# EAGLE board RF08-1 (EAGLE 6.6.0), part 1 of 2
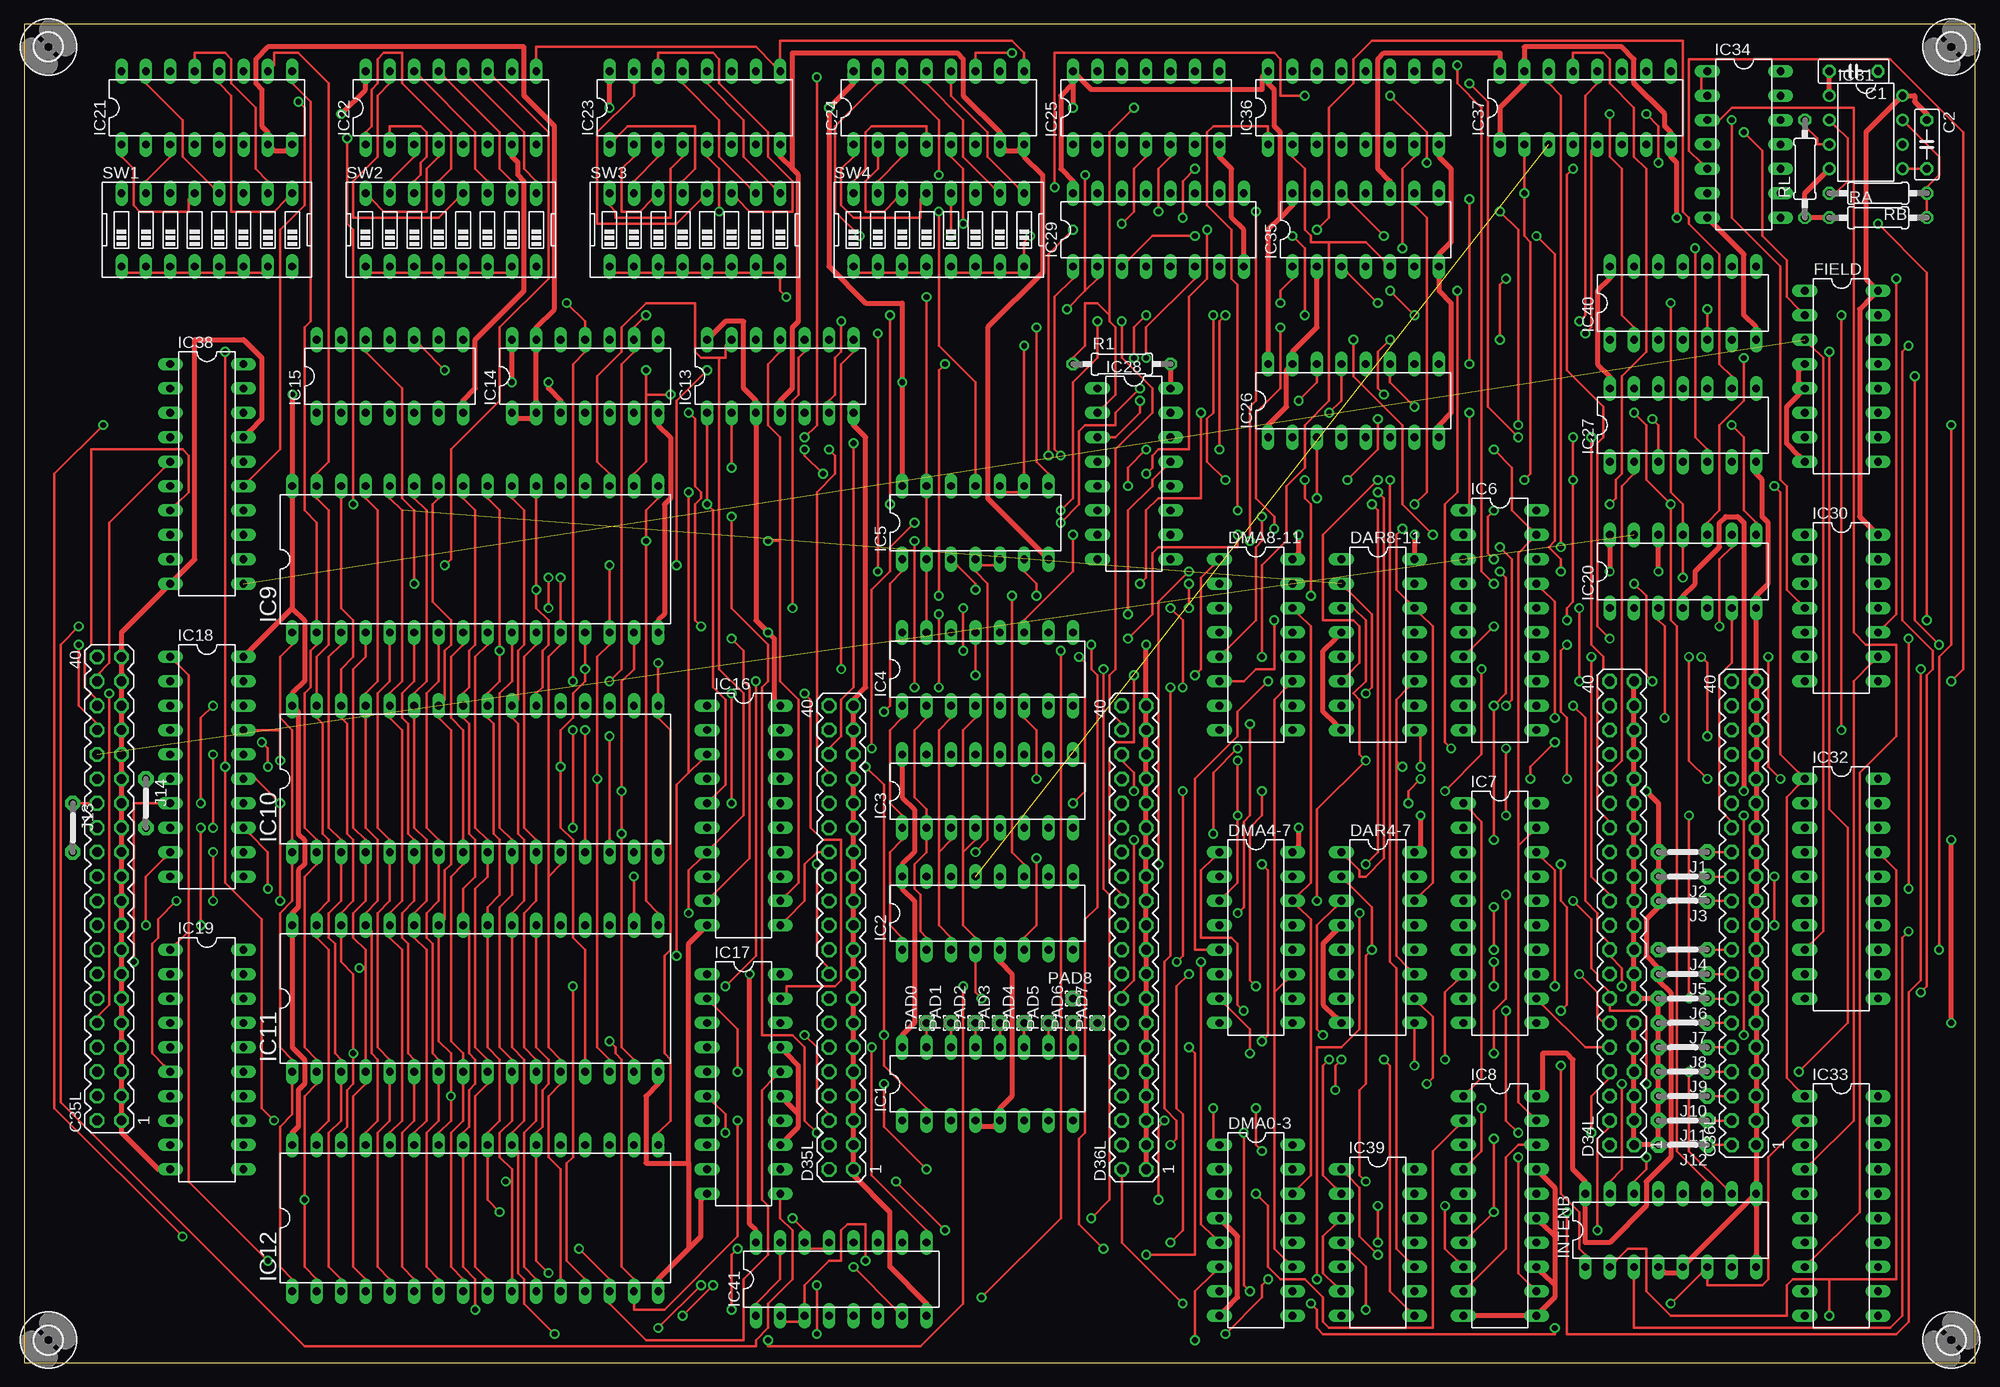
[diagram p3: board, top side]
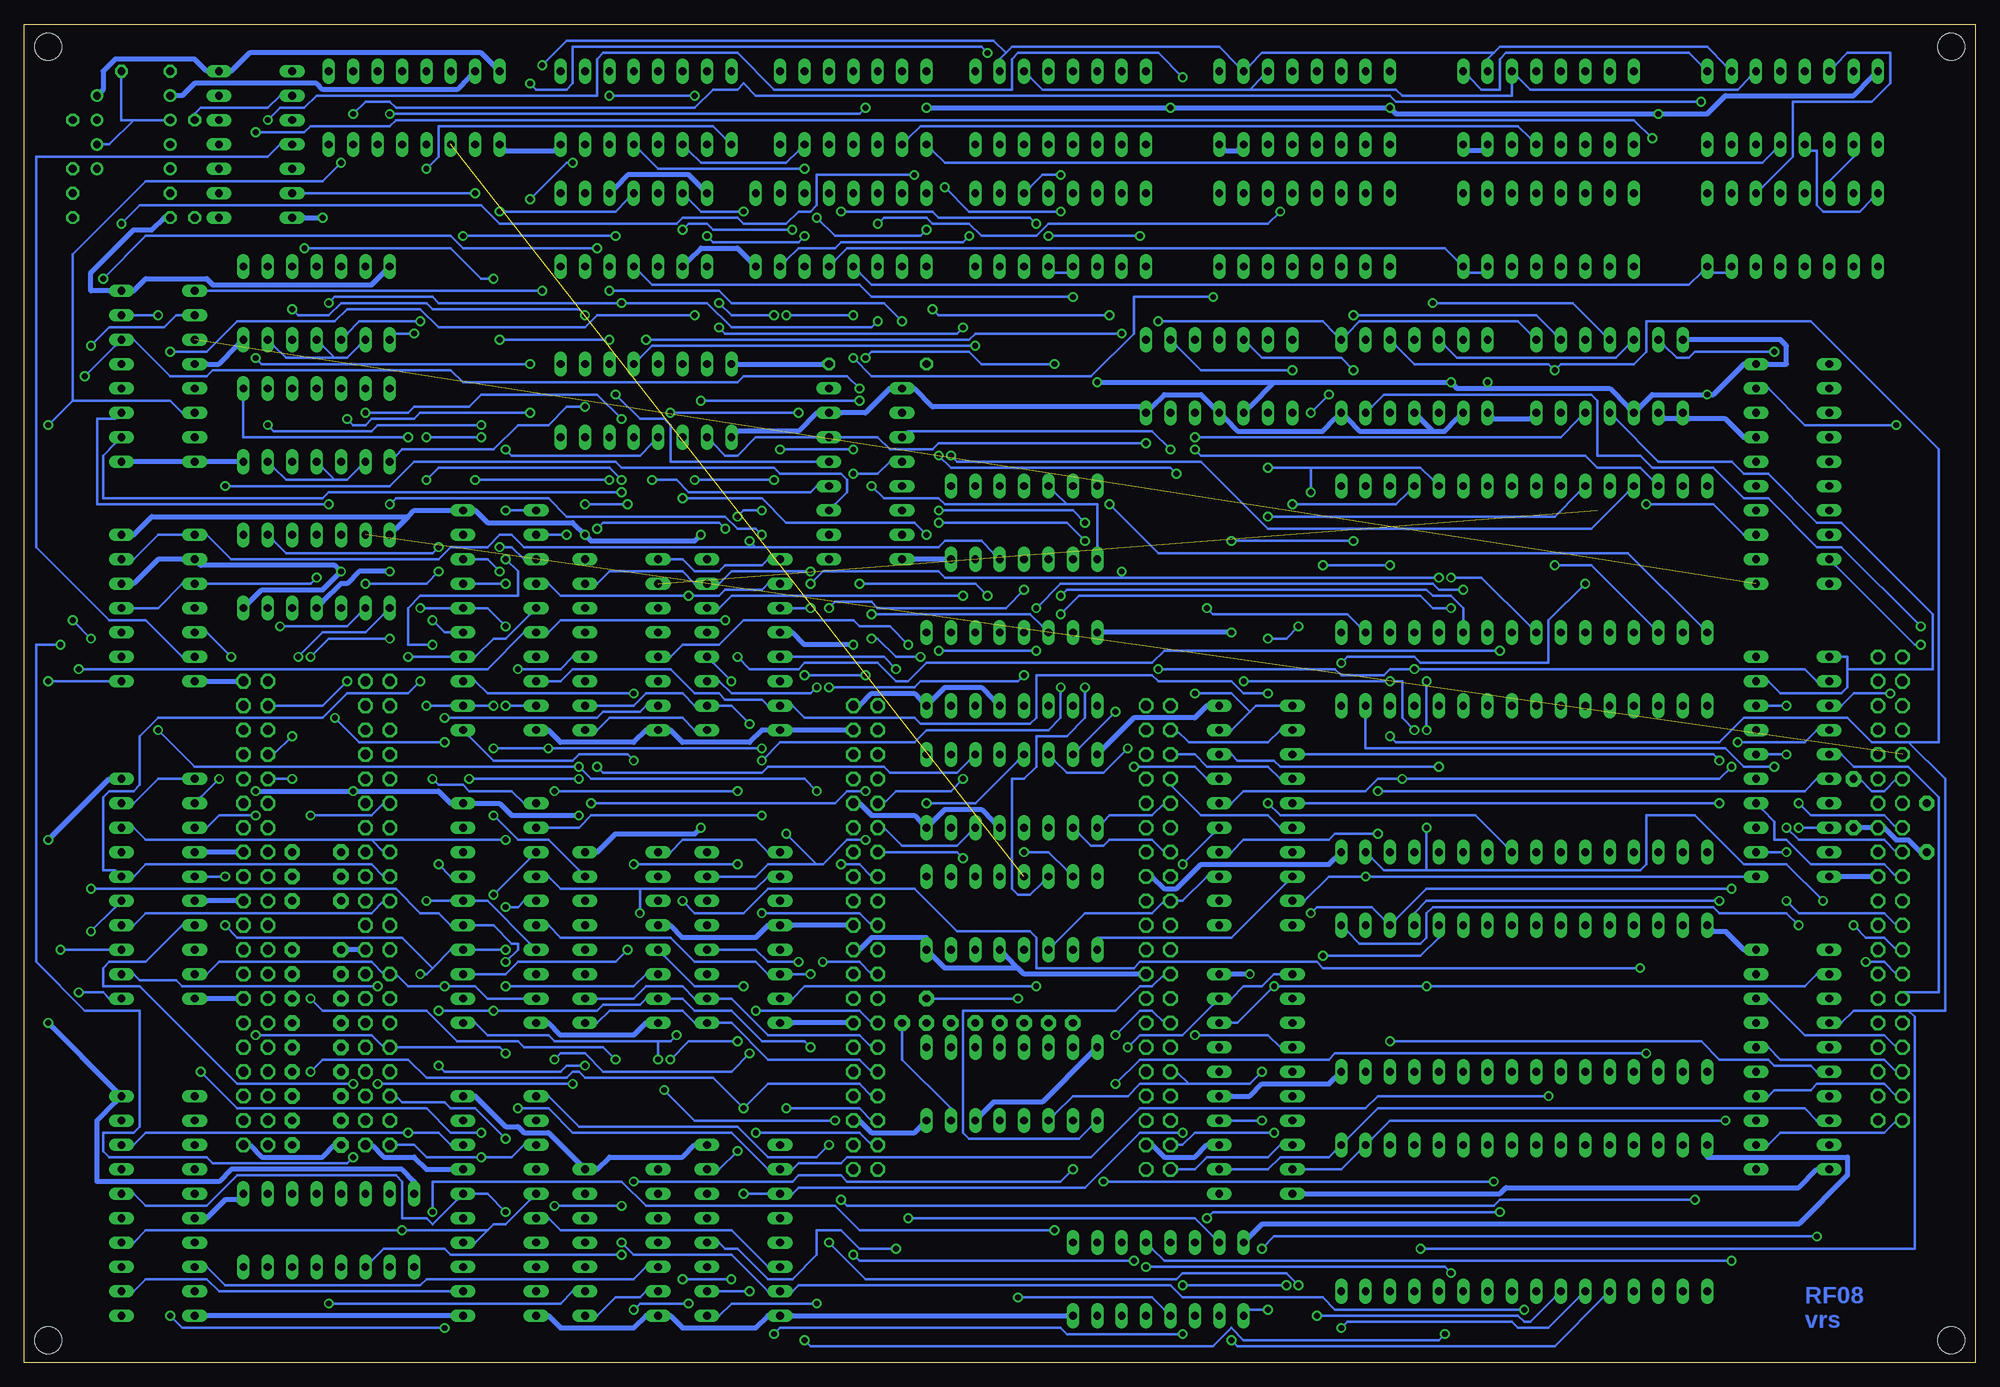
[diagram p4: board, bottom side, seen from below]

Size 203.18 x 139.37 mm. Coordinates in mm from the lower left corner, seen from the top.
Outline: 0,0 203.18,0 203.18,139.37 0,139.37 0,0
Copper layers (1*16): Top 0.035mm / dielectric 1.5mm / Bottom 0.035mm
Design rules "default": minimum track width 10mil, minimum drill 24mil, track to track 8mil, track to pad 8mil, pad to pad 8mil, via to via 8mil, smd to smd 8mil, copper to edge 40mil, drill to drill 8mil, minimum pad ring 10mil, minimum via ring 8mil, stop-mask expansion 4mil, vias tented up to drill 0mil, thermal gap 10mil
Net classes: 1 Power: width 0.508 mm

## Footprints (pad centres in the part's own frame; a part is rotated, then mirrored left to right if it is on the bottom)
C050-025X075 = drill 0.813 octagon: 1 -2.54,0; 2 2.54,0
MA20-2 = drill 1.016 octagon: 1 -24.13,-1.27; 2 -24.13,1.27; 3 -21.59,-1.27; 4 -21.59,1.27; 5 -19.05,-1.27; 6 -19.05,1.27; 7 -16.51,-1.27; 8 -16.51,1.27; 9 -13.97,-1.27; 10 -13.97,1.27; 11 -11.43,-1.27; 12 -11.43,1.27; 13 -8.89,-1.27; 14 -8.89,1.27; 15 -6.35,-1.27; 16 -6.35,1.27; 17 -3.81,-1.27; 18 -3.81,1.27; 19 -1.27,-1.27; 20 -1.27,1.27; 21 1.27,-1.27; 22 1.27,1.27; 23 3.81,-1.27; 24 3.81,1.27; 25 6.35,-1.27; 26 6.35,1.27; 27 8.89,-1.27; 28 8.89,1.27; 29 11.43,-1.27; 30 11.43,1.27; 31 13.97,-1.27; 32 13.97,1.27; 33 16.51,-1.27; 34 16.51,1.27; 35 19.05,-1.27; 36 19.05,1.27; 37 21.59,-1.27; 38 21.59,1.27; 39 24.13,-1.27; 40 24.13,1.27
DIL16 = drill 0.813 long: 1 -8.89,-3.81; 2 -6.35,-3.81; 3 -3.81,-3.81; 4 -1.27,-3.81; 5 1.27,-3.81; 6 3.81,-3.81; 7 6.35,-3.81; 8 8.89,-3.81; 9 8.89,3.81; 10 6.35,3.81; 11 3.81,3.81; 12 1.27,3.81; 13 -1.27,3.81; 14 -3.81,3.81; 15 -6.35,3.81; 16 -8.89,3.81
DIL14 = drill 0.813 long: 1 -7.62,-3.81; 2 -5.08,-3.81; 3 -2.54,-3.81; 4 0,-3.81; 5 2.54,-3.81; 6 5.08,-3.81; 7 7.62,-3.81; 8 7.62,3.81; 9 5.08,3.81; 10 2.54,3.81; 11 0,3.81; 12 -2.54,3.81; 13 -5.08,3.81; 14 -7.62,3.81
DIL20 = drill 0.813 long: 1 -11.43,-3.81; 2 -8.89,-3.81; 3 -6.35,-3.81; 4 -3.81,-3.81; 5 -1.27,-3.81; 6 1.27,-3.81; 7 3.81,-3.81; 8 6.35,-3.81; 9 8.89,-3.81; 10 11.43,-3.81; 11 11.43,3.81; 12 8.89,3.81; 13 6.35,3.81; 14 3.81,3.81; 15 1.27,3.81; 16 -1.27,3.81; 17 -3.81,3.81; 18 -6.35,3.81; 19 -8.89,3.81; 20 -11.43,3.81
DIL32 = drill 0.813 long: 1 -19.05,-7.62; 2 -16.51,-7.62; 3 -13.97,-7.62; 4 -11.43,-7.62; 5 -8.89,-7.62; 6 -6.35,-7.62; 7 -3.81,-7.62; 8 -1.27,-7.62; 9 1.27,-7.62; 10 3.81,-7.62; 11 6.35,-7.62; 12 8.89,-7.62; 13 11.43,-7.62; 14 13.97,-7.62; 15 16.51,-7.62; 16 19.05,-7.62; 17 19.05,7.62; 18 16.51,7.62; 19 13.97,7.62; 20 11.43,7.62; 21 8.89,7.62; 22 6.35,7.62; 23 3.81,7.62; 24 1.27,7.62; 25 -1.27,7.62; 26 -3.81,7.62; 27 -6.35,7.62; 28 -8.89,7.62; 29 -11.43,7.62; 30 -13.97,7.62; 31 -16.51,7.62; 32 -19.05,7.62
DIL08 = drill 0.813 pad 1.27: 1 -3.81,-3.81; 2 -1.27,-3.81; 3 1.27,-3.81; 4 3.81,-3.81; 5 3.81,3.81; 6 1.27,3.81; 7 -1.27,3.81; 8 -3.81,3.81
05 = drill 0.813 pad 1.6 octagon: 1 -2.54,0; 2 2.54,0
1,6/0,8 = drill 0.813 pad 1.6 octagon: 1 0,0
0207/10 = drill 0.813 octagon: 1 -5.08,0; 2 5.08,0
EDG-08 = drill 0.813 long: 1 -8.89,-3.81; 2 -6.35,-3.81; 3 -3.81,-3.81; 4 -1.27,-3.81; 5 1.27,-3.81; 6 3.81,-3.81; 7 6.35,-3.81; 8 8.89,-3.81; 9 8.89,3.81; 10 6.35,3.81; 11 3.81,3.81; 12 1.27,3.81; 13 -1.27,3.81; 14 -3.81,3.81; 15 -6.35,3.81; 16 -8.89,3.81
2,8 = hole 2.8: 0,0

## Placement (x,y rotation side)
C1  .1uf  [C050-025X075]  190.5,134.46 180 top
C2  .1uf  [C050-025X075]  198.12,126.83 270 top
C35L  [MA20-2]  8.88,49.37 90 top
C36L  [MA20-2]  179.06,46.83 90 top
D34L  [MA20-2]  166.37,46.83 90 top
D35L  [MA20-2]  85.09,44.29 90 top
D36L  [MA20-2]  115.56,44.29 90 top
DAR4-7  74LS193N  [DIL16]  140.97,44.29 270 top
DAR8-11  74LS193N  [DIL16]  140.97,74.77 270 top
DMA0-3  74LS193N  [DIL16]  128.27,13.81 270 top
DMA4-7  74LS193N  [DIL16]  128.27,44.29 270 top
DMA8-11  74LS193N  [DIL16]  128.27,74.77 270 top
FIELD  74LS193N  [DIL16]  189.22,102.7 270 top
IC1  74S138N  [DIL16]  100.33,29.05 0 top
IC2  74S138N  [DIL16]  100.33,46.83 0 top
IC3  74S138N  [DIL16]  100.33,59.52 0 top
IC4  74S138N  [DIL16]  100.33,72.22 0 top
IC5  74LS00N  [DIL14]  99.06,87.46 0 top
IC6  74S240N  [DIL20]  153.66,77.3 270 top
IC7  74S240N  [DIL20]  153.66,46.83 270 top
IC8  74S240N  [DIL20]  153.66,16.35 270 top
IC9  628512  [DIL32]  46.98,83.65 0 top
IC10  628512  [DIL32]  46.98,60.8 0 top
IC11  628512  [DIL32]  46.98,37.94 0 top
IC12  628512  [DIL32]  46.98,15.08 0 top
IC13  74180N  [DIL14]  78.73,102.7 0 top
IC14  74180N  [DIL14]  58.41,102.7 0 top
IC15  74180N  [DIL14]  38.09,102.7 0 top
IC16  74LS244N  [DIL20]  74.93,56.98 270 top
IC17  74LS244N  [DIL20]  74.93,29.05 270 top
IC18  74S240N  [DIL20]  19.05,62.06 270 top
IC19  74S240N  [DIL20]  19.05,31.59 270 top
IC20  74S74N  [DIL14]  172.72,82.38 0 top
IC21  74LS151N  [DIL16]  19.05,130.65 0 top
IC22  74LS151N  [DIL16]  44.45,130.65 0 top
IC23  74LS151N  [DIL16]  69.84,130.65 0 top
IC24  74LS151N  [DIL16]  95.25,130.65 0 top
IC25  74LS20N  [DIL14]  116.84,130.65 0 top
IC26  74S139N  [DIL16]  138.43,100.16 0 top
IC27  7407N  [DIL14]  172.72,97.62 0 top
IC28  74S139N  [DIL16]  115.56,92.54 270 top
IC29  74LS139N  [DIL16]  118.11,117.94 0 top
IC30  74S74N  [DIL14]  189.22,78.57 270 top
IC31  LM555N  [DIL08]  191.77,128.11 270 top
IC32  74S240N  [DIL20]  189.22,49.37 270 top
IC33  74S240N  [DIL20]  189.22,16.35 270 top
IC34  74LS00N  [DIL14]  179.06,126.83 270 top
IC35  74S74N  [DIL14]  139.69,117.94 0 top
IC36  74S139N  [DIL16]  138.43,130.65 0 top
IC37  74LS139N  [DIL16]  162.56,130.65 0 top
IC38  74S240N  [DIL20]  19.05,92.54 270 top
IC39  74S03N  [DIL14]  140.97,12.54 270 top
IC40  7407N  [DIL14]  172.72,110.32 0 top
IC41  74LS139N  [DIL16]  85.09,8.73 0 top
INTENB  74LS193N  [DIL16]  171.44,13.81 0 top
J1  J5MM  [05]  172.72,53.18 180 top
J2  J5MM  [05]  172.72,50.63 180 top
J3  J5MM  [05]  172.72,48.09 180 top
J4  J5MM  [05]  172.72,43.02 180 top
J5  J5MM  [05]  172.72,40.48 180 top
J6  J5MM  [05]  172.72,37.94 180 top
J7  J5MM  [05]  172.72,35.4 180 top
J8  J5MM  [05]  172.72,32.86 180 top
J9  J5MM  [05]  172.72,30.32 180 top
J10  J5MM  [05]  172.72,27.78 180 top
J11  J5MM  [05]  172.72,25.23 180 top
J12  J5MM  [05]  172.72,22.7 180 top
J13  J5MM  [05]  5.08,55.72 270 top
J14  J5MM  [05]  12.69,58.26 270 top
PAD0  [1,6/0,8]  93.98,35.4 90 top
PAD1  [1,6/0,8]  96.52,35.4 90 top
PAD2  [1,6/0,8]  99.06,35.4 90 top
PAD3  [1,6/0,8]  101.59,35.4 90 top
PAD4  [1,6/0,8]  104.14,35.4 90 top
PAD5  [1,6/0,8]  106.68,35.4 90 top
PAD6  [1,6/0,8]  109.22,35.4 90 top
PAD7  [1,6/0,8]  111.76,35.4 90 top
PAD8  [1,6/0,8]  109.22,37.94 90 top
R1  4.7K  [0207/10]  114.3,103.97 0 top
RA  470K  [0207/10]  193.03,119.21 0 top
RB  1.5K  [0207/10]  193.03,121.75 180 top
RL  1K  [0207/10]  185.41,124.29 90 top
SW1  [EDG-08]  19.05,117.94 0 top
SW2  [EDG-08]  44.45,117.94 0 top
SW3  [EDG-08]  69.84,117.94 0 top
SW4  [EDG-08]  95.25,117.94 0 top
U$1  [2,8]  200.66,137 0 top
U$2  [2,8]  2.54,137 0 top
U$3  [2,8]  2.54,2.38 0 top
U$4  [2,8]  200.66,2.38 0 top

## Tracks (layer width: path | path; a pad name or v marks a point on that pad's centre or on a via)
!3CYC
  Top 0.254: C35L.28 6.98,58.26 5.71,58.26 J13.1
!601  (via drill 0.61)
  Top 0.254: v99.06,53.18 100.33,54.45 100.33,81.11 99.06,82.38 IC5.4 99.69,83.02 100.96,83.02 IC5.5 | v128.27,119.85 128.27,100.16 127.63,99.53 v127.63,85.56
  Bottom 0.254: IC30.13 191.77,83.65 189.22,86.19 186.69,86.19 IC30.1 184.15,86.19 181.61,83.65 160.02,83.65 158.75,84.92 154.94,84.92 153.66,86.19 152.4,86.19 151.12,84.92 127,84.92 | v99.06,53.18 96.52,53.18 94.61,51.27 IC2.15 | v128.27,119.85 132.71,119.85 133.98,121.12 IC35.13 | v127.63,85.56 127,84.92 | 127,84.92 107.95,84.92 107.31,85.56 103.5,85.56 102.23,84.29 IC5.5
!602  (via drill 0.61)
  Top 0.254: v89.53,67.78 90.17,68.41 90.17,81.11 91.44,82.38 IC5.1 | v130.81,110.32 130.81,111.59 132.08,112.86 IC35.1 | v125.09,109.05 124.45,108.42 v124.45,95.08 | v116.84,95.08 114.93,93.18 v114.93,91.27
  Bottom 0.254: 94.61,89.37 91.44,89.37 91.44,84.92 IC5.1 | 94.61,89.37 95.88,90.64 IC5.12 | v89.53,67.78 93.34,63.97 IC3.15 | v130.81,110.32 129.53,109.05 v125.09,109.05 | v116.84,95.08 v124.45,95.08 | v114.93,91.27 113.66,90 107.95,90 107.31,89.37 94.61,89.37
!604  (via drill 0.61)
  Top 0.254: IC4.15 93.98,77.3 93.98,82.38 IC5.2 93.98,84.92 93.98,90 IC5.13 93.98,92.54 v93.98,110.96
  Bottom 0.254: v93.98,110.96 114.93,110.96 116.2,112.23 137.79,112.23 139.06,113.5 IC35.4
!611  (via drill 0.61)
  Top 0.254: v92.7,85.56 v92.7,70.32 | v107.95,87.46 109.85,89.37 109.85,96.99 110.48,97.62 113.66,97.62 113.66,98.89 v116.2,101.43 | v168.91,21.43 168.91,20.16 167.63,18.89 INTENB.14 | v199.38,74.77 196.84,77.3 v196.84,102.7
  Bottom 0.254: v92.7,70.32 92.7,67.14 94.61,65.24 97.79,65.24 97.79,62.06 99.06,60.8 100.33,60.8 100.33,49.37 99.69,48.73 98.42,48.73 97.15,50 IC2.14 | v92.7,85.56 94.61,87.46 v107.95,87.46 | v116.2,101.43 117.47,102.7 128.27,102.7 128.9,102.07 157.47,102.07 158.75,103.34 183.51,103.34 184.15,102.7 187.96,102.7 191.77,106.52 FIELD.14 193.67,105.88 v196.84,102.7 | v168.91,21.43 169.54,20.79 183.51,20.79 184.15,21.43 194.31,21.43 194.94,22.06 194.94,23.96 191.77,23.96 191.13,24.6 191.13,36.66 196.84,36.66 201.93,41.74 201.93,74.77 v199.38,74.77
!612  (via drill 0.61)
  Top 0.254: v88.26,63.97 88.26,80.48 90.17,82.38 90.17,84.92 v92.7,87.46 | v107.95,88.73 109.22,90 109.22,102.07 111.76,104.61 v111.76,108.42 | v144.78,109.05 v142.24,111.59 | v175.25,109.69 175.25,107.78 IC40.5
  Bottom 0.254: v88.26,63.97 90.8,61.43 94.61,61.43 95.88,62.7 IC3.14 | v92.7,87.46 93.98,88.73 v107.95,88.73 | v111.76,108.42 113.66,110.32 129.53,110.32 130.81,111.59 v142.24,111.59 | v144.78,109.05 145.41,109.69 160.65,109.69 161.28,110.32 170.18,110.32 171.44,109.05 174.62,109.05 v175.25,109.69
!614  (via drill 0.61)
  Top 0.254: v114.93,77.94 114.93,88.73 117.47,91.27 117.47,91.91 118.74,93.18 IC28.13 | v173.99,116.04 173.99,96.35 175.25,95.08 IC27.5 | v154.3,112.86 153.66,112.23 v153.66,106.52 | v142.24,106.52 140.97,105.24 140.97,101.43 v141.6,100.8
  Bottom 0.254: v114.93,77.94 98.42,77.94 97.15,76.67 IC4.14 | v173.99,116.04 158.75,116.04 155.57,112.86 v154.3,112.86 | v153.66,106.52 v142.24,106.52 | v141.6,100.8 139.06,98.26 136.52,98.26 135.88,97.62 135.88,93.81 120.65,93.81 IC28.13
!621  (1 unrouted)
!622  (via drill 0.61)
  Top 0.254: v109.22,58.26 110.48,59.52 110.48,72.86 v109.85,73.49 | v114.93,75.4 117.47,77.94 117.47,84.29 118.11,84.92 126.36,84.92 v126.36,86.19 | v165.09,89.37 165.73,90 165.73,91.91 166.37,92.54 166.37,102.7 168.91,105.24 168.91,124.29 167.63,125.56 167.63,130.65 165.09,133.19 165.09,135.72 164.46,136.36 161.28,136.36 161.28,135.72 IC37.13
  Bottom 0.254: v109.22,58.26 104.14,58.26 99.69,62.7 IC3.13 | v109.85,73.49 112.39,73.49 114.3,75.4 v114.93,75.4 | v126.36,86.19 127,86.83 128.9,86.83 130.17,88.1 146.68,88.1 148.59,90 164.46,90 v165.09,89.37
!624  (via drill 0.61)
  Top 0.254: v150.49,98.89 150.49,89.37 IC6.1 | v169.54,98.26 170.18,97.62 170.18,95.08 IC27.3 | v99.06,71.59 99.06,74.77 IC4.13 | v119.38,70.32 119.38,42.38 118.74,41.74 118.74,26.51 120.01,25.23 120.01,23.33 v119.38,22.7 | IC7.1 150.49,57.62 151.76,56.35 151.76,29.68 150.49,28.41 IC8.1 | v153.03,88.73 152.4,88.1 152.4,84.29 v153.03,83.65 | v160.65,74.77 160.02,74.13 160.02,67.78 160.65,67.14 v160.65,60.8
  Bottom 0.254: v150.49,98.89 161.92,98.89 162.56,98.26 167,98.26 167.63,97.62 168.91,97.62 v169.54,98.26 | v99.06,71.59 99.69,70.95 109.85,70.95 110.48,70.32 v119.38,70.32 | v119.38,22.7 120.65,21.43 125.73,21.43 128.9,24.6 145.41,24.6 148.59,27.78 IC8.1 | v153.03,88.73 151.12,88.73 IC6.1 | v153.03,83.65 151.76,82.38 151.76,79.84 161.92,79.84 163.19,78.57 163.19,74.77 v160.65,74.77 | v160.65,60.8 160.02,60.16 157.47,60.16 156.84,59.52 152.4,59.52 151.12,58.26 IC7.1
!641  (via drill 0.61)
  Top 0.254: v102.87,79.84 102.87,53.18 104.14,51.91 IC2.11 | v116.2,81.11 116.84,81.75 116.84,88.73 118.11,90 122.55,90 v122.55,98.89 | v135.88,98.89 137.16,100.16 137.16,102.7 IC26.13
  Bottom 0.254: v102.87,79.84 104.14,81.11 v116.2,81.11 | v122.55,98.89 v135.88,98.89
!642  (via drill 0.61)
  Top 0.254: v143.5,62.06 142.87,62.7 | 142.87,62.7 142.87,69.05 144.14,70.32 DAR8-11.11 | 142.87,62.7 142.87,42.38 144.14,41.11 DAR4-7.11
  Bottom 0.254: v143.5,62.06 142.87,61.43 126.36,61.43 125.73,62.06 113.66,62.06 113.03,61.43 106.04,61.43 104.77,62.7 IC3.11
!644  (via drill 0.61)
  Top 0.254: v109.22,86.19 109.22,82.38 104.14,77.3 IC4.11 | v134.62,90 134.62,95.08 IC26.3
  Bottom 0.254: v109.22,86.19 110.48,87.46 123.82,87.46 126.36,90 v134.62,90
!645  (via drill 0.61)
  Top 0.254: 155.57,53.81 155.57,27.14 156.84,25.87 IC8.19 | 155.57,53.81 156.84,55.08 IC7.19 | 155.57,53.81 155.57,84.29 156.84,85.56 IC6.19 156.84,86.83 154.94,88.73 154.94,93.18 v153.03,95.08
  Bottom 0.254: v153.03,95.08 152.4,94.45 139.06,94.45 137.79,95.72 IC26.4
!ACB00  (via drill 0.61)
  Top 0.254: v155.57,21.43 155.57,9.36 156.84,8.09 IC8.12
  Bottom 0.254: IC8.3 151.12,22.7 152.4,21.43 v155.57,21.43 161.28,21.43 162.56,22.7 164.46,22.7 D34L.2 | IC8.12 158.75,7.46 182.88,7.46 184.15,8.73 190.5,8.73 191.77,7.46 IC33.12
!ACB01  (via drill 0.61)
  Top 0.254: v163.83,13.81 163.83,23.33 165.09,24.6 D34L.4
  Bottom 0.254: 154.94,13.81 154.3,14.44 153.03,14.44 150.49,16.98 IC8.5 | 154.94,13.81 156.21,12.54 IC8.14 | 154.94,13.81 v163.83,13.81 190.5,13.81 191.77,12.54 IC33.14
!ACB02  (via drill 0.61)
  Top 0.254: IC8.7 150.49,13.17 v153.03,15.71 v153.03,23.33
  Bottom 0.254: v153.03,15.71 154.94,17.62 156.21,17.62 IC8.16 158.11,16.98 160.65,14.44 161.28,15.08 163.83,15.08 163.83,18.89 164.46,19.52 180.97,19.52 184.15,16.35 190.5,16.35 191.77,17.62 IC33.16 | v153.03,23.33 156.21,26.51 158.75,26.51 159.38,27.14 163.83,27.14 164.46,27.78 D34L.6
!ACB03  (via drill 0.61)
  Top 0.254: IC8.9 150.49,8.09 154.3,11.9 154.3,21.43 155.57,22.7 156.21,22.7 IC8.18 | v163.19,23.96 163.19,27.78 165.09,29.68 D34L.8
  Bottom 0.254: IC33.18 191.77,22.7 190.5,23.96 v163.19,23.96 160.02,23.96 158.75,22.7 IC8.18
!ACB04  (via drill 0.61)
  Top 0.254: v154.3,48.73 154.3,37.94 153.03,36.66 v153.03,32.22 | IC7.12 158.11,37.3 162.56,32.86 164.46,32.86 D34L.10 | v179.06,34.12 v179.06,56.98
  Bottom 0.254: v154.3,48.73 150.49,52.54 IC7.3 | v153.03,32.22 153.66,32.86 164.46,32.86 D34L.10 165.73,32.86 167,34.12 v179.06,34.12 | v179.06,56.98 182.88,56.98 184.15,55.72 IC32.3
!ACB05  (via drill 0.61)
  Top 0.254: v161.92,40.48 163.83,38.57 163.83,36.03 164.46,35.4 D34L.12 | v153.03,43.02 v153.03,47.46 | v182.24,45.55 v182.24,50.63
  Bottom 0.254: 160.65,41.11 161.28,40.48 v161.92,40.48 | 160.65,41.11 158.75,43.02 IC7.14 156.21,43.02 v153.03,43.02 | v153.03,47.46 151.76,47.46 151.12,48.09 IC7.5 | v182.24,50.63 184.15,50.63 IC32.5 | v182.24,45.55 180.97,44.29 163.83,44.29 160.65,41.11
!ACB06  (via drill 0.61)
  Top 0.254: v168.91,29.05 168.91,36.03 168.27,36.66 165.09,36.66 165.09,37.3 D34L.14 165.09,38.57 163.83,39.84 163.83,40.48 163.19,41.11 163.19,46.19 v161.28,48.09
  Bottom 0.254: IC7.7 150.49,43.65 154.94,48.09 156.21,48.09 IC7.16 158.75,48.09 v161.28,48.09 | v168.91,29.05 180.97,29.05 191.13,39.2 194.94,39.2 194.94,41.11 194.31,41.74 190.5,41.74 186.69,45.55 IC32.7
!ACB07  (via drill 0.61)
  Top 0.254: v159.38,39.2 159.38,51.27 158.11,52.54 IC7.18
  Bottom 0.254: IC7.9 151.12,37.94 154.94,37.94 156.21,39.2 v159.38,39.2 163.19,39.2 164.46,40.48 D34L.16 165.73,40.48 167,41.74 182.88,41.74 184.15,40.48 IC32.9
!ACB08  (via drill 0.61)
  Top 0.254: v166.37,39.2 166.37,41.11 165.09,42.38 D34L.18 165.09,43.65 163.83,44.92 163.83,46.83 162.56,48.09 162.56,67.14 v161.28,68.41 | v153.66,84.92 154.94,83.65 154.94,69.05 v154.3,68.41
  Bottom 0.254: v166.37,39.2 186.69,39.2 187.32,39.84 191.13,39.84 191.77,40.48 IC32.12 | v161.28,68.41 158.75,68.41 IC6.12 156.21,68.41 v154.3,68.41 | v153.66,84.92 152.4,84.92 151.12,83.65 IC6.3
!ACB09  (via drill 0.61)
  Top 0.254: v163.19,73.49 163.19,50.63 165.09,48.73 D34L.22
  Bottom 0.254: IC6.5 150.49,77.94 153.03,75.4 154.3,75.4 156.21,73.49 IC6.14 158.75,73.49 v163.19,73.49 | IC32.14 191.77,45.55 190.5,46.83 167,46.83 165.73,48.09 D34L.22
!ACB10  (via drill 0.61)
  Top 0.254: v153.03,76.67 150.49,74.13 IC6.7 | v161.92,70.95 v161.92,78.57
  Bottom 0.254: v153.03,76.67 154.94,78.57 156.21,78.57 IC6.16 158.75,78.57 v161.92,78.57 | D34L.24 165.73,50.63 167,51.91 190.5,51.91 191.77,50.63 IC32.16 193.67,51.27 194.94,51.27 194.94,58.89 194.31,59.52 191.77,59.52 191.13,60.16 191.13,65.24 189.22,67.14 172.08,67.14 169.54,69.68 163.19,69.68 v161.92,70.95
!ACB11  (via drill 0.61)
  Top 0.254: v153.66,82.38 154.3,81.75 154.3,69.68 v153.03,68.41 v153.03,54.45
  Bottom 0.254: v153.03,68.41 151.12,68.41 IC6.9 | v153.66,82.38 154.94,83.65 156.21,83.65 IC6.18 | 167,54.45 190.5,54.45 191.77,55.72 IC32.18 | 167,54.45 165.73,53.18 D34L.26 | v153.03,54.45 167,54.45
!ACCLEAR
  Top 0.254: D34L.32 165.09,61.43 166.37,62.7 166.37,91.27 167.63,92.54 IC27.2
  Bottom 0.254: 170.81,91.91 169.54,91.91 168.27,93.18 IC27.2 | 170.81,91.91 172.08,93.18 IC27.4 | 170.81,91.91 175.89,91.91 177.16,93.18 IC27.6
!BADDAC  (via drill 0.61)
  Top 0.254: v174.62,73.49 175.25,72.86 v175.25,65.24
  Bottom 0.254: v174.62,73.49 172.08,76.03 167.63,76.03 165.73,77.94 IC20.1 | v175.25,65.24 177.16,63.34 C36L.34
!BBREAK  (via drill 0.61)
  Top 0.254: IC41.1 76.2,6.18 78.73,8.73 78.73,11.27 IC41.15 | v128.9,88.1 128.9,85.56 128.27,84.92 128.27,77.3 125.09,74.13 DMA8-11.5 | v126.36,88.73 126.36,112.23 125.73,112.86 125.73,117.94 123.19,120.48 123.19,128.11 123.82,128.74 129.53,128.74 129.53,128.11 IC36.1 | v175.25,60.8 173.35,62.7 v173.35,73.49 | v165.09,75.4 163.83,76.67 163.83,95.72 164.46,96.35 164.46,99.53 160.65,103.34 160.65,123.66 v161.28,124.29 | v111.12,15.08 113.03,16.98 113.03,48.73 112.39,49.37 v112.39,72.22 | v8.25,97.62 3.17,92.54 3.17,26.51 v16.51,13.17 | v74.29,11.9 73.66,11.27 v73.66,5.55
  Bottom 0.254: v128.9,88.1 128.27,88.73 v126.36,88.73 | v175.25,60.8 177.16,60.8 C36L.32 | v173.35,73.49 171.44,75.4 v165.09,75.4 | v161.28,124.29 160.02,125.56 160.02,128.74 131.44,128.74 130.17,127.47 IC36.1 | v111.12,15.08 81.28,15.08 79.37,13.17 IC41.15 | v112.39,72.22 113.66,73.49 123.19,73.49 DMA8-11.5 | v8.25,97.62 17.78,97.62 21.59,101.43 IC38.19 | v16.51,13.17 73.02,13.17 v74.29,11.9 | v73.66,5.55 75.56,5.55 IC41.1
!BINIT  (via drill 0.61)
  Top 0.254: v141.6,117.31 137.79,121.12 IC35.12 | v157.47,117.31 159.38,115.4 159.38,85.56 158.75,84.92 160.02,83.65 v160.02,82.38 | v167.63,81.11 168.91,79.84 168.91,71.59 v169.54,70.95
  Bottom 0.254: v141.6,117.31 v157.47,117.31 | v160.02,82.38 161.28,81.11 v167.63,81.11 | v169.54,70.95 172.08,68.41 177.16,68.41 C36L.38
!BRK_RQ
  Top 0.254: IC20.6 177.8,77.3 177.8,72.86 176.53,71.59 176.53,57.62 177.8,56.35 C36L.28
!BWCO  (1 unrouted)
!CA_INCR
  Bottom 0.254: C35L.30 8.25,60.8 9.52,59.52 10.79,59.52 12.06,60.8 J14.1
!DA00
  Top 0.254: C36L.2 177.16,22.7 175.89,22.7 J12.1
!DA01
  Top 0.254: C36L.4 177.16,25.23 175.89,25.23 J11.1
!DA02
  Top 0.254: C36L.6 177.16,27.78 175.89,27.78 J10.1
!DA03
  Top 0.254: C36L.8 177.16,30.32 175.89,30.32 J9.1
!DA04
  Top 0.254: C36L.10 177.16,32.86 175.89,32.86 J8.1
!DA05
  Top 0.254: C36L.12 177.16,35.4 175.89,35.4 J7.1
!DA06
  Top 0.254: C36L.14 177.16,37.94 175.89,37.94 J6.1
!DA07
  Top 0.254: C36L.16 177.16,40.48 175.89,40.48 J5.1
!DA08
  Top 0.254: C36L.18 177.16,43.02 175.89,43.02 J4.1
!DA09
  Top 0.254: C36L.22 177.16,48.09 175.89,48.09 J3.1
!DA10
  Top 0.254: C36L.24 177.16,50.63 175.89,50.63 J2.1
!DA11
  Top 0.254: C36L.26 177.16,53.18 175.89,53.18 J1.1
!DATA00
  Bottom 0.254: IC19.12 21.59,22.7 20.32,23.96 9.52,23.96 8.25,25.23 C35L.2
!DATA01
  Bottom 0.254: IC19.14 21.59,27.78 20.95,28.41 17.14,28.41 16.51,29.05 9.52,29.05 8.25,27.78 C35L.4
!DATA02
  Bottom 0.254: IC19.16 21.59,32.86 20.32,31.59 9.52,31.59 8.25,30.32 C35L.6
!DATA03
  Bottom 0.254: IC19.18 21.59,37.94 17.78,34.12 9.52,34.12 8.25,32.86 C35L.8
!DATA04  (via drill 0.61)
  Top 0.254: v8.88,69.68 8.88,37.3 7.62,36.03 C35L.10
  Bottom 0.254: v8.88,69.68 12.69,69.68 13.96,68.41 IC18.3
!DATA05
  Bottom 0.254: IC18.5 13.96,63.34 12.69,62.06 6.98,62.06 3.81,58.89 3.81,38.57 7.62,38.57 C35L.12
!DATA06  (via drill 0.61)
  Top 0.254: v11.42,41.74 11.42,58.26 13.96,58.26 IC18.7
  Bottom 0.254: v11.42,41.74 9.52,41.74 8.25,40.48 C35L.14
!DATA07  (via drill 0.61)
  Top 0.254: v12.69,45.55 12.69,50.63 14.6,52.54 IC18.9
  Bottom 0.254: v12.69,45.55 11.42,44.29 9.52,44.29 8.25,43.02 C35L.16
!DATA08  (via drill 0.61)
  Top 0.254: v19.68,48.09 v19.68,53.18
  Bottom 0.254: v19.68,53.18 21.59,53.18 IC18.12 | v19.68,48.09 18.41,46.83 9.52,46.83 8.25,45.55 C35L.18
!DATA09
  Bottom 0.254: IC18.14 22.22,57.62 20.95,56.35 20.95,54.45 19.68,54.45 17.14,51.91 9.52,51.91 8.25,50.63 C35L.22
!DATA10  (via drill 0.61)
  Top 0.254: v19.68,55.72 v19.68,63.34
  Bottom 0.254: v19.68,63.34 21.59,63.34 IC18.16 | v19.68,55.72 18.41,54.45 9.52,54.45 8.25,53.18 C35L.24
!DATA11  (via drill 0.61)
  Top 0.254: v19.68,68.41 18.41,67.14 v18.41,58.26
  Bottom 0.254: v19.68,68.41 21.59,68.41 IC18.18 | v18.41,58.26 17.14,56.98 9.52,56.98 8.25,55.72 C35L.26
!DCXA  (via drill 0.61)
  Top 0.254: IC5.10 102.23,90.64 103.5,90.64 IC5.9 104.14,92.54 v104.14,105.88
  Bottom 0.254: v104.14,105.88 137.79,105.88 139.06,104.61 IC26.12
!DIMA  (via drill 0.61)
  Top 0.254: IC33.1 184.78,28.41 183.51,29.68 183.51,58.89 184.78,60.16 IC32.1 184.78,61.43 182.88,63.34 182.88,90.64 v182.24,91.27
  Bottom 0.254: v182.24,91.27 165.09,91.27 162.56,93.81 141.6,93.81 140.97,93.18 125.09,93.18 124.45,92.54 118.11,92.54 117.47,91.91 117.47,90.64 118.74,89.37 IC28.11 | IC32.19 191.77,58.26 189.22,60.8 186.69,60.8 IC32.1
!DIML  (via drill 0.61)
  Top 0.254: INTENB.11 175.25,18.89 172.08,22.06 172.08,76.67 171.44,77.3 v171.44,89.37 168.91,91.91 168.91,97.62 v167.63,98.89 | v137.79,91.91 140.97,95.08 v140.97,98.26
  Bottom 0.254: v171.44,89.37 195.58,89.37 195.58,98.26 193.67,98.26 FIELD.11 | v137.79,91.91 135.25,91.91 133.98,90.64 121.28,90.64 120.65,91.27 IC28.12 | v140.97,98.26 143.5,100.8 155.57,100.8 156.84,99.53 162.56,99.53 163.19,98.89 v167.63,98.89
!DMA-IN  (via drill 0.61)
  Top 0.254: 17.14,44.92 15.87,43.65 IC19.1 | 17.14,44.92 17.14,71.59 15.87,72.86 IC18.1 | v25.39,10.63 17.14,18.89 17.14,44.92
  Bottom 0.254: 13.33,72.22 13.33,73.49 13.96,73.49 IC18.1 | 13.33,72.22 13.33,70.32 13.96,69.68 20.32,69.68 21.59,70.95 IC18.19 | v25.39,10.63 84.45,10.63 85.72,11.9 IC41.12 | 13.33,72.22 4.44,72.22 4.44,77.94 13.96,87.46 16.51,87.46 21.59,92.54 24.12,92.54 25.39,93.81 33.02,93.81 37.46,98.26 IC15.4
!DMA-OUT  (via drill 0.61)
  Top 0.254: v88.26,32.86 88.26,19.52 93.98,13.81 IC41.9 | v81.28,69.68 81.91,69.05 81.91,55.72 83.18,54.45 85.09,54.45 85.09,39.84 84.45,39.2 79.37,39.2 79.37,38.57 IC17.19
  Bottom 0.254: 75.56,67.78 74.93,68.41 72.39,68.41 IC16.1 | 75.56,67.78 77.47,65.88 IC16.19 | IC17.1 72.39,40.48 73.02,40.48 74.29,39.2 76.2,39.2 77.47,37.94 IC17.19 79.37,37.3 82.55,34.12 86.99,34.12 v88.26,32.86 | 75.56,67.78 77.47,69.68 v81.28,69.68
!DRV01  (via drill 0.61)
  Top 0.254: IC10.22 53.34,69.68 53.97,70.32 53.97,74.13 54.6,74.77 54.6,77.3 53.34,78.57 v53.34,80.48 53.34,90 IC9.22 | v99.69,6.82 107.95,15.08 v107.95,74.13 | v97.79,74.13 v97.79,78.57
  Bottom 0.254: v99.69,6.82 85.72,6.82 84.45,5.55 IC41.4 | v107.95,74.13 v97.79,74.13 | v97.79,78.57 95.25,81.11 56.51,81.11 55.88,80.48 v53.34,80.48
!DRV23  (via drill 0.61)
  Top 0.254: IC11.22 53.34,44.29 53.34,32.86 54.6,31.59 54.6,29.05 53.97,28.41 53.97,24.6 53.34,23.96 IC12.22 53.34,21.43 53.34,10.63 v54.6,9.36 | v86.36,10 90.8,5.55 IC41.7
  Bottom 0.254: v86.36,10 55.24,10 v54.6,9.36
!EXAD0  (via drill 0.61)
  Top 0.254: v5.71,74.77 5.71,68.41 7.62,66.51 C35L.34
  Bottom 0.254: v5.71,74.77 6.34,74.77 14.6,83.02 IC38.9
!EXAD1
  Top 0.254: IC38.7 15.87,89.37 17.14,90.64 17.14,94.45 16.51,95.08 6.98,95.08 6.98,74.77 6.34,74.13 6.34,70.32 7.62,69.05 C35L.36
!EXAD2
  Top 0.254: IC38.5 14.6,93.18 8.88,87.46 8.88,72.86 7.62,71.59 C35L.38
!INT_RQ  (via drill 0.61)
  Top 0.254: IC39.3 136.52,14.44 135.25,13.17 135.25,9.36 136.52,8.09 IC39.6 | v173.35,37.94 v173.35,56.98 | v141.6,31.59 142.24,30.95 142.24,7.46 144.14,5.55 IC39.8
  Bottom 0.254: IC39.6 138.43,7.46 139.06,6.82 141.6,6.82 143.5,4.92 IC39.8 | v173.35,56.98 167,56.98 165.73,58.26 D34L.30 | v173.35,37.94 172.08,36.66 161.28,36.66 158.11,33.49 151.76,33.49 151.12,32.86 142.87,32.86 v141.6,31.59
!IOS  (via drill 0.61)
  Top 0.254: v163.19,96.35 163.19,74.77 164.46,73.49 164.46,72.22 163.83,71.59 163.83,57.62 165.09,56.35 D34L.28
  Bottom 0.254: v163.19,96.35 180.34,96.35 180.34,100.16 IC27.8
!MYDEV  (via drill 0.61)
  Top 0.254: 97.79,53.18 97.79,45.55 99.06,44.29 IC2.4 99.06,41.74 99.06,38.57 v99.69,37.94 | 97.79,53.18 99.06,54.45 IC3.4 | 97.79,53.18 97.79,65.88 99.06,67.14 IC4.4
  Bottom 0.254: v99.69,37.94 108.58,37.94 PAD8.1
!PER
  Bottom 0.254: IC30.6 186.69,73.49 190.5,77.3 194.31,77.3 201.93,84.92 201.93,125.56 177.8,125.56 176.53,126.83 IC34.4
!SETPER  (via drill 0.61)
  Top 0.254: v81.28,96.35 82.55,97.62 v82.55,133.82 | v177.8,129.38 177.8,119.21 182.88,114.13 182.88,91.91 183.51,91.27 183.51,80.48 184.78,79.21 IC30.4
  Bottom 0.254: v81.28,96.35 43.17,96.35 41.27,98.26 IC15.5 | v82.55,133.82 85.09,136.36 99.69,136.36 100.33,135.72 100.33,132.55 125.09,132.55 128.9,136.36 142.87,136.36 143.5,135.72 143.5,131.92 172.72,131.92 173.99,130.65 176.53,130.65 v177.8,129.38
!SETWLS  (via drill 0.61)
  Top 0.254: v194.94,112.86 194.94,77.94 193.67,76.67 IC30.10 | v143.5,116.04 143.5,124.29 144.78,125.56 IC36.7
  Bottom 0.254: v194.94,112.86 190.5,117.31 158.75,117.31 157.47,116.04 v143.5,116.04
!SKIP  (via drill 0.61)
  Top 0.254: 113.03,109.05 113.03,108.42 113.66,107.78 113.66,100.8 112.39,99.53 IC28.2 | 113.03,109.05 111.76,110.32 110.48,110.32 110.48,105.88 109.22,104.61 R1.1 | v165.09,130.01 165.09,125.56 166.37,124.29 166.37,109.05 167.63,107.78 IC40.2 | v115.56,130.65 113.03,128.11 113.03,109.05
  Bottom 0.254: 170.81,104.61 169.54,104.61 168.27,105.88 IC40.2 | 170.81,104.61 172.08,105.88 IC40.4 | 170.81,104.61 175.89,104.61 177.16,105.88 IC40.6 | v165.09,130.01 116.2,130.01 v115.56,130.65
!START  (via drill 0.61)
  Top 0.254: 130.17,38.57 130.17,11.9 131.44,10.63 DMA0-3.11 | 130.17,38.57 131.44,39.84 DMA4-7.11 | 130.17,38.57 130.17,69.05 131.44,70.32 DMA8-11.11 | v99.06,80.48 99.06,81.11 97.15,83.02 IC5.3 | v119.38,78.57 120.65,77.3 v120.65,70.32
  Bottom 0.254: v99.06,80.48 100.96,78.57 114.3,78.57 114.93,79.21 118.74,79.21 v119.38,78.57 | v120.65,70.32 121.28,69.68 129.53,69.68 130.81,70.95 DMA8-11.11
!WE  (via drill 0.61)
  Top 0.254: IC12.29 35.55,23.96 36.82,25.23 36.82,31.59 36.19,32.22 36.19,44.92 IC11.29 35.55,46.83 36.82,48.09 36.82,54.45 35.55,55.72 35.55,67.14 IC10.29 35.55,69.68 36.82,70.95 36.82,88.73 35.55,90 IC9.29 | v121.92,124.29 120.65,123.02 v120.65,119.21 | v109.22,117.94 106.68,115.4 v106.68,94.45
  Bottom 0.254: v121.92,124.29 137.16,124.29 139.06,126.2 IC36.5 | v120.65,119.21 118.74,117.31 109.85,117.31 v109.22,117.94 | v106.68,94.45 106.04,93.81 80.64,93.81 73.66,86.83 40,86.83 36.19,90.64 IC9.29
!WLS  (via drill 0.61)
  Top 0.254: v200.66,70.95 201.93,72.22 201.93,128.11 194.31,135.72 173.35,135.72 173.35,126.2 174.62,124.93 IC34.5
  Bottom 0.254: v200.66,70.95 194.31,70.95 IC30.8
BAC00  (via drill 0.61)
  Top 0.254: v120.65,6.18 114.3,12.54 114.3,19.52 D36L.2
  Bottom 0.254: v120.65,6.18 129.53,6.18 130.81,4.92 DMA0-3.9
BAC01  (via drill 0.61)
  Top 0.254: v127.63,7.46 127,8.09 v127,23.96
  Bottom 0.254: v127.63,7.46 130.81,7.46 DMA0-3.10 | v127,23.96 116.2,23.96 114.93,22.7 D36L.4
BAC02  (via drill 0.61)
  Top 0.254: v123.82,26.51 123.82,23.33 DMA0-3.1
  Bottom 0.254: v123.82,26.51 116.2,26.51 114.93,25.23 D36L.6
BAC03  (via drill 0.61)
  Top 0.254: v128.9,22.06 128.27,22.7 v128.27,26.51 | v173.35,30.32 173.35,22.06 177.16,18.25 INTENB.10
  Bottom 0.254: v128.9,22.06 130.81,20.16 DMA0-3.15 | D36L.8 114.93,27.78 116.2,29.05 125.73,29.05 v128.27,26.51 131.44,29.68 144.78,29.68 145.41,30.32 146.05,30.32 146.68,29.68 161.28,29.68 163.19,31.59 172.08,31.59 v173.35,30.32
BAC04  (via drill 0.61)
  Top 0.254: v160.02,30.95 160.02,17.62 161.92,15.71 161.92,11.9 162.56,11.27 INTENB.1 | v144.78,30.95 144.78,34.76 DAR4-7.9
  Bottom 0.254: DAR4-7.9 143.5,35.4 142.24,36.66 134.62,36.66 133.34,35.4 DMA4-7.9 130.81,35.4 129.53,35.4 125.73,31.59 116.2,31.59 114.93,30.32 D36L.10 | v160.02,30.95 159.38,30.32 147.31,30.32 146.68,30.95 v144.78,30.95
BAC05  (via drill 0.61)
  Top 0.254: v166.37,29.05 166.37,20.16 165.09,18.89 INTENB.15 | v146.05,29.05 146.68,29.68 146.68,36.03 145.41,37.3 DAR4-7.10
  Bottom 0.254: DAR4-7.10 143.5,37.94 139.69,37.94 138.43,39.2 134.62,39.2 133.34,37.94 DMA4-7.10 130.81,37.94 129.53,37.94 125.73,34.12 116.2,34.12 114.93,32.86 D36L.12 | v146.05,29.05 v166.37,29.05
BAC06  (via drill 0.61)
  Top 0.254: v140.97,90.64 141.6,90 141.6,52.54 139.69,50.63 139.06,50.63 139.06,51.27 137.79,52.54 DAR4-7.1 | v127,36.66 126.36,37.3 126.36,43.65 125.73,44.29 122.55,44.29 122.55,51.27 123.82,52.54 DMA4-7.1
  Bottom 0.254: DMA4-7.1 125.73,53.18 127,54.45 134.62,54.45 135.88,53.18 DAR4-7.1 | v140.97,90.64 171.44,90.64 172.08,90 194.94,90 194.94,94.45 193.67,95.72 FIELD.10 | v127,36.66 116.2,36.66 114.93,35.4 D36L.14
BAC07  (via drill 0.61)
  Top 0.254: v115.56,54.45 115.56,39.84 114.3,38.57 D36L.16 | v154.3,63.97 v154.3,56.98 | v126.36,63.97 123.82,61.43 v123.82,55.08 | v149.22,111.59 149.22,90.64 147.95,89.37 147.95,64.6 v148.59,63.97
  Bottom 0.254: 120.65,51.91 120.01,51.91 117.47,54.45 v115.56,54.45 | 120.65,51.91 125.73,51.91 127,50.63 130.81,50.63 DMA4-7.15 | v154.3,56.98 151.76,54.45 148.59,54.45 145.41,51.27 DAR4-7.15 | v126.36,63.97 v148.59,63.97 v154.3,63.97 | v123.82,55.08 120.65,51.91 | v149.22,111.59 184.15,111.59 FIELD.1
BAC08  (via drill 0.61)
  Top 0.254: v189.22,65.88 v189.22,109.05 | v145.41,62.06 145.41,65.24 DAR8-11.9 | v120.01,41.74 120.65,42.38 v120.65,59.52
  Bottom 0.254: DMA8-11.9 133.34,65.88 134.62,67.14 142.24,67.14 143.5,65.88 DAR8-11.9 | v189.22,109.05 191.77,109.05 FIELD.15 | v189.22,65.88 185.41,62.06 v145.41,62.06 144.14,60.8 121.92,60.8 v120.65,59.52 | v120.01,41.74 116.2,41.74 114.93,40.48 D36L.18
BAC09  (via drill 0.61)
  Top 0.254: v126.36,46.83 127,47.46 127,56.35 127.63,56.98 v127.63,66.51
  Bottom 0.254: DAR8-11.10 143.5,68.41 139.69,68.41 138.43,69.68 134.62,69.68 133.34,68.41 DMA8-11.10 130.81,68.41 129.53,68.41 v127.63,66.51 | v126.36,46.83 116.2,46.83 114.93,45.55 D36L.22
BAC10  (via drill 0.61)
  Top 0.254: v115.56,71.59 115.56,64.6 113.66,64.6 113.03,63.97 113.03,50 114.3,48.73 D36L.24 | v121.92,71.59 122.55,72.22 122.55,81.75 123.82,83.02 DMA8-11.1
  Bottom 0.254: DMA8-11.1 125.73,83.65 126.36,83.02 130.17,83.02 130.81,82.38 133.34,82.38 134.62,83.65 135.88,83.65 DAR8-11.1 | v115.56,71.59 v121.92,71.59
BAC11  (via drill 0.61)
  Top 0.254: v118.11,51.91 118.11,79.21 v121.28,82.38
  Bottom 0.254: DAR8-11.15 143.5,81.11 142.24,82.38 134.62,82.38 133.34,81.11 DMA8-11.15 130.81,81.11 129.53,82.38 v121.28,82.38 | v118.11,51.91 116.2,51.91 114.93,50.63 D36L.26
BINIT  (via drill 0.61)
  Top 0.254: v172.72,81.75 172.72,84.92 IC20.11 172.72,87.46 172.72,89.37 171.44,90.64 v171.44,110.32 | v140.97,110.32 137.79,113.5 IC35.3 | v114.3,108.42 114.3,104.61 117.47,101.43 117.47,98.89 113.66,95.08 113.66,72.22 113.03,71.59 113.03,67.78 114.3,66.51 D36L.38
  Bottom 0.254: IC30.11 191.77,78.57 189.22,78.57 186.69,81.11 IC30.3 184.15,81.11 173.35,81.11 v172.72,81.75 | v171.44,110.32 170.81,110.96 160.65,110.96 160.02,110.32 v140.97,110.32 132.08,110.32 129.53,107.78 114.93,107.78 v114.3,108.42
BIOP1  (via drill 0.61)
  Top 0.254: v105.41,52.54 105.41,45.55 104.14,44.29 IC2.6
  Bottom 0.254: v105.41,52.54 106.04,53.18 113.66,53.18 D36L.28
BIOP2
  Bottom 0.254: IC3.6 104.77,55.08 106.04,53.81 111.76,53.81 113.66,55.72 D36L.30
BIOP4  (via drill 0.61)
  Top 0.254: v105.41,60.8 105.41,65.88 104.14,67.14 IC4.6
  Bottom 0.254: v105.41,60.8 106.68,59.52 112.39,59.52 113.66,58.26 D36L.32
BMB00
  Bottom 0.254: IC17.8 72.39,22.7 73.66,21.43 80.01,21.43 81.28,20.16 83.18,20.16 D35L.2
BMB01  (via drill 0.61)
  Top 0.254: v73.02,23.96 73.02,25.87 71.75,27.14 IC17.6
  Bottom 0.254: v73.02,23.96 81.28,23.96 82.55,22.7 83.18,22.7 D35L.4
BMB02  (via drill 0.61)
  Top 0.254: v81.28,34.12 82.55,32.86 82.55,27.14 83.81,25.87 D35L.6
  Bottom 0.254: v81.28,34.12 73.66,34.12 72.39,32.86 IC17.4
BMB03  (via drill 0.61)
  Top 0.254: v74.29,30.32 74.29,34.76 71.75,37.3 IC17.2
  Bottom 0.254: v74.29,30.32 75.56,29.05 81.91,29.05 | 81.91,29.05 83.18,30.32 D35L.10 | 81.91,29.05 86.99,29.05 88.26,27.78 93.98,27.78 95.88,25.87 IC1.3
BMB04  (via drill 0.61)
  Top 0.254: IC1.2 93.98,26.51 89.53,30.95 v89.53,34.12 89.53,60.16 v87.62,62.06
  Bottom 0.254: v89.53,34.12 86.99,36.66 85.72,36.66 84.45,35.4 D35L.14 | v87.62,62.06 81.28,62.06 80.01,60.8 IC16.17
BMB05  (via drill 0.61)
  Top 0.254: v82.55,51.91 82.55,42.38 83.81,41.11 D35L.18
  Bottom 0.254: IC1.1 92.07,24.6 93.34,23.33 104.77,23.33 105.41,23.96 105.41,36.66 89.53,36.66 86.99,39.2 85.72,39.2 84.45,40.48 D35L.18 | v82.55,51.91 79.37,55.08 IC16.15
BMB06
  Top 0.254: 95.25,53.18 95.25,45.55 96.52,44.29 IC2.3 | 95.25,53.18 96.52,54.45 IC3.3 | 95.25,53.18 95.25,65.88 96.52,67.14 IC4.3
  Bottom 0.254: IC16.13 80.01,50.63 82.55,48.09 83.18,48.09 D35L.24 84.45,48.09 85.72,46.83 92.7,46.83 95.88,43.65 IC2.3
BMB07
  Top 0.254: IC16.11 79.37,46.19 81.28,48.09 81.28,51.91 82.55,53.18 83.18,53.18 D35L.28 | IC2.2 93.98,44.29 93.34,44.92 93.34,48.73 92.7,49.37 92.7,51.91 93.98,53.18 93.98,54.45 IC3.2 93.98,56.98 93.98,57.62 92.7,58.89 92.7,65.88 93.98,67.14 IC4.2
  Bottom 0.254: D35L.28 84.45,53.18 85.72,54.45 90.17,54.45 90.8,53.81 92.07,53.81 93.34,55.08 IC3.2
BMB08
  Top 0.254: IC4.1 91.44,67.14 90.17,65.88 90.17,58.26 91.44,56.98 IC3.1 91.44,54.45 90.17,53.18 90.17,45.55 91.44,44.29 IC2.1
  Bottom 0.254: IC3.1 90.8,56.35 90.17,56.98 85.72,56.98 84.45,58.26 D35L.32 | IC16.8 71.75,50 77.47,44.29 91.44,44.29 IC2.1
BMB09  (via drill 0.61)
  Top 0.254: v116.2,100.16 116.2,98.89 113.66,96.35 113.03,96.35 IC28.3 | v132.71,100.16 134.62,102.07 134.62,102.7 IC26.14 | v83.81,95.08 84.45,94.45 84.45,92.54 82.55,90.64 82.55,62.7 83.81,61.43 D35L.34
  Bottom 0.254: IC16.6 72.39,55.72 73.66,56.98 80.64,56.98 83.81,60.16 D35L.34 | v116.2,100.16 v132.71,100.16 | v83.81,95.08 85.72,96.99 111.12,96.99 IC28.3
BMB10  (via drill 0.61)
  Top 0.254: v86.36,95.72 86.36,70.32 85.09,69.05 85.09,65.24 83.81,63.97 D35L.36
  Bottom 0.254: IC26.2 131.44,95.72 130.17,94.45 128.9,94.45 127,96.35 120.65,96.35 IC28.14 118.11,96.35 114.3,96.35 113.03,95.08 108.58,95.08 107.95,95.72 v86.36,95.72 | IC16.4 72.39,60.8 73.66,62.06 80.01,62.06 81.28,63.34 83.18,63.34 D35L.36
BMB11
  Bottom 0.254: IC16.2 72.39,65.88 73.66,64.6 81.91,64.6 83.18,65.88 D35L.38
BTS1  (via drill 0.61)
  Top 0.254: v170.81,67.14 170.81,76.67 170.18,77.3 IC20.3 | v159.38,64.6 156.84,62.06 v156.84,60.8 | v145.41,60.8 144.14,59.52 v144.14,58.26 | v115.56,59.52 115.56,61.43 114.3,62.7 D36L.36
  Bottom 0.254: v170.81,67.14 168.27,64.6 v159.38,64.6 | v145.41,60.8 v156.84,60.8 | v144.14,58.26 118.74,58.26 117.47,59.52 v115.56,59.52
BUSY  (via drill 0.61)
  Top 0.254: v176.53,76.67 176.53,83.65 177.8,84.92 IC20.9 | v160.02,84.92 160.02,131.92 158.75,133.19 IC37.14
  Bottom 0.254: v176.53,76.67 169.54,76.67 168.27,77.94 IC20.2 | v160.02,84.92 160.65,84.29 175.89,84.29 177.16,85.56 IC20.9
CIE  (via drill 0.61)
  Top 0.254: v140.97,11.27 139.06,13.17 139.06,18.25 137.79,19.52 IC39.1 | v196.21,44.92 195.58,44.29 195.58,4.92 194.31,3.65 167.63,3.65 167.63,8.73 INTENB.3
  Bottom 0.254: v140.97,11.27 158.75,11.27 159.38,11.9 165.73,11.9 167,10.63 INTENB.3 | v196.21,44.92 193.67,47.46 IC32.15
DAR04  (via drill 0.61)
  Top 0.254: IC41.2 79.37,4.28 80.64,4.28 IC41.3 81.28,6.18 81.28,8.09 83.81,10.63 85.09,10.63 85.09,13.81 85.72,14.44 87.62,14.44 v87.62,10.63 | v160.02,36.66 160.65,37.3 160.65,47.46 160.02,48.09 v160.02,51.91 | v121.92,117.31 117.47,117.31 114.93,114.77 IC29.3 | v132.08,117.31 133.34,116.04 v133.34,109.05 | v187.96,105.24 187.96,57.62 189.86,55.72 189.86,35.4 v184.78,30.32 | v155.57,23.96 154.3,25.23 v154.3,36.66 | v116.84,11.27 121.92,11.27 121.92,32.22 v121.28,32.86
  Bottom 0.254: v160.02,36.66 v154.3,36.66 143.5,36.66 142.87,37.3 139.06,37.3 138.43,37.94 DAR4-7.7 135.88,37.94 134.62,37.94 133.34,36.66 129.53,36.66 126.36,33.49 121.92,33.49 v121.28,32.86 | v160.02,51.91 158.75,50.63 IC7.17 | v121.92,117.31 122.55,116.67 131.44,116.67 v132.08,117.31 | v133.34,109.05 143.5,109.05 144.78,107.78 160.02,107.78 161.92,109.69 169.54,109.69 170.81,108.42 180.97,108.42 184.15,105.24 v187.96,105.24 | v184.78,30.32 180.97,26.51 161.28,26.51 158.75,23.96 v155.57,23.96 | v87.62,10.63 116.2,10.63 v116.84,11.27
DAR05  (via drill 0.61)
  Top 0.254: v153.03,41.74 v153.03,39.2 | IC12.1 27.94,8.73 26.67,10 26.67,24.6 27.94,25.87 27.94,29.05 IC11.1 27.94,31.59 26.67,32.86 26.67,46.83 27.94,48.09 27.94,51.91 IC10.1 27.94,54.45 27.94,65.88 26.67,67.14 26.67,73.49 27.94,74.77 IC9.1 | 110.48,111.59 v108.58,109.69 | 110.48,111.59 111.76,112.86 IC29.2 | v90.17,109.05 v90.17,89.37 | v196.21,75.4 v196.21,49.37 | v198.12,77.3 198.12,113.5 v193.03,118.58 | v110.48,123.66 110.48,111.59
  Bottom 0.254: v153.03,39.2 139.69,39.2 138.43,40.48 DAR4-7.6 | v153.03,41.74 151.76,43.02 151.76,43.65 152.4,43.65 154.3,45.55 156.21,45.55 IC7.15 158.75,45.55 160.02,46.83 161.92,46.83 164.46,49.37 v196.21,49.37 | v108.58,109.69 107.95,109.05 v90.17,109.05 | v90.17,89.37 85.09,84.29 36.19,84.29 28.57,76.67 IC9.1 | v198.12,77.3 v196.21,75.4 | v193.03,118.58 191.13,120.48 155.57,120.48 153.66,118.58 135.25,118.58 134.62,119.21 128.9,119.21 128.27,118.58 123.82,118.58 122.55,119.85 121.28,119.85 120.65,120.48 120.65,123.66 v110.48,123.66
DAR06  (via drill 0.61)
  Top 0.254: DAR4-7.2 137.79,50 140.33,47.46 v140.33,43.02 139.69,42.38 139.69,29.05 139.06,28.41 139.06,19.52 v139.69,18.89 | IC12.30 33.02,23.96 33.65,24.6 33.65,28.41 34.28,29.05 v34.28,32.22 34.28,40.48 33.02,41.74 33.02,44.29 IC11.30 33.02,46.83 34.28,48.09 34.28,54.45 33.65,55.08 33.65,66.51 33.02,67.14 IC10.30 33.02,69.68 33.02,72.22 34.28,73.49 34.28,77.3 33.02,78.57 33.02,90 IC9.30 | v107.95,94.45 107.31,95.08 107.31,110.96 109.22,112.86 IC29.1 | v83.18,92.54 81.28,94.45 v81.28,95.08 | v93.98,20.16 89.53,24.6 v89.53,29.05
  Bottom 0.254: v140.33,43.02 141.6,41.74 151.76,41.74 153.03,40.48 156.21,40.48 IC7.13 | v107.95,94.45 106.68,93.18 83.81,93.18 v83.18,92.54 | v81.28,95.08 80.64,94.45 40.63,94.45 39.36,93.18 34.92,93.18 33.65,91.91 IC9.30 | v139.69,18.89 123.19,18.89 122.55,19.52 118.11,19.52 117.47,18.89 95.25,18.89 v93.98,20.16 | v89.53,29.05 86.99,31.59 67.31,31.59 66.67,32.22 v34.28,32.22
DAR07  (via drill 0.61)
  Top 0.254: IC22.9 53.34,135.72 53.34,137 76.2,137 78.1,135.09 IC23.9 78.73,135.72 78.73,137.63 102.87,137.63 104.14,136.36 104.14,135.72 IC24.9 | v135.25,34.12 134.62,34.76 134.62,45.55 136.52,47.46 DAR4-7.3 | IC12.2 30.48,8.73 29.21,10 v29.21,16.98 29.21,27.78 30.48,29.05 IC11.2 30.48,31.59 29.21,32.86 29.21,50.63 30.48,51.91 IC10.2 30.48,54.45 29.21,55.72 29.21,69.68 29.84,70.32 29.84,74.13 30.48,74.77 IC9.2 30.48,77.3 30.48,87.46 29.21,88.73 29.21,107.78 29.84,108.42 29.84,131.28 27.94,133.19 IC21.9 | v137.16,31.59 136.52,30.95 v136.52,28.41 | v118.74,25.23 118.11,24.6 v118.11,16.98
  Bottom 0.254: IC21.9 28.57,135.09 29.84,136.36 48.89,136.36 49.52,135.72 49.52,132.55 51.43,132.55 52.7,133.82 IC22.9 | 137.16,33.49 135.88,33.49 v135.25,34.12 | 137.16,33.49 147.95,33.49 148.59,34.12 154.94,34.12 156.21,35.4 IC7.11 | v137.16,31.59 137.16,33.49 | v136.52,28.41 133.34,25.23 v118.74,25.23 | v118.11,16.98 117.47,16.35 50.16,16.35 49.52,16.98 v29.21,16.98
DAR08  (via drill 0.61)
  Top 0.254: IC12.31 30.48,23.96 31.75,25.23 31.75,43.02 30.48,44.29 IC11.31 30.48,46.83 31.75,48.09 31.75,54.45 31.11,55.08 31.11,66.51 30.48,67.14 IC10.31 30.48,69.68 30.48,73.49 31.75,74.77 31.75,88.73 30.48,90 IC9.31 30.48,92.54 31.75,93.81 31.75,133.19 28.57,136.36 26.03,136.36 26.03,135.09 IC21.10 | v159.38,67.14 159.38,79.21 158.11,80.48 IC6.17 | v153.03,81.11 151.76,82.38 151.76,130.65 149.22,133.19 v149.22,135.09
  Bottom 0.254: v159.38,67.14 143.5,67.14 142.87,67.78 139.06,67.78 138.43,68.41 DAR8-11.7 | 50.16,136.36 50.79,135.72 IC22.10 | 50.16,136.36 49.52,137 27.94,137 26.03,135.09 IC21.10 | 50.16,136.36 74.29,136.36 75.56,135.09 IC23.10 76.83,135.09 78.73,137 100.33,137 100.96,136.36 | 100.96,136.36 101.59,135.72 IC24.10 | v153.03,81.11 156.21,81.11 IC6.17 | v149.22,135.09 146.68,137.63 102.23,137.63 100.96,136.36
DAR09  (via drill 0.61)
  Top 0.254: IC12.3 33.02,8.73 31.75,10 31.75,23.96 33.02,25.23 33.02,29.05 IC11.3 33.02,31.59 32.38,32.22 32.38,43.65 31.75,44.29 31.75,46.83 33.02,48.09 33.02,51.91 IC10.3 33.02,54.45 31.75,55.72 31.75,73.49 33.02,74.77 IC9.3 | v140.97,91.91 135.25,86.19 135.25,77.3 138.43,77.3 139.06,76.67 139.06,72.86 137.79,71.59 DAR8-11.6 | v160.65,77.3 160.65,78.57 161.28,79.21 v161.28,91.91 v161.28,96.35 | v155.57,96.35 152.4,99.53 152.4,131.28 v150.49,133.19 | v102.87,136.36 99.06,136.36 99.06,135.72 IC24.11 | v43.81,83.02 44.45,83.65 44.45,95.08 49.52,100.16 49.52,107.78 54.6,112.86 54.6,128.11 48.89,133.82 IC22.11
  Bottom 0.254: v140.97,91.91 142.24,93.18 160.02,93.18 v161.28,91.91 | v160.65,77.3 159.38,76.03 158.75,76.03 IC6.15 | IC21.11 23.49,133.82 24.76,132.55 46.35,132.55 47.62,133.82 IC22.11 48.25,133.19 48.25,131.92 59.68,131.92 60.32,132.55 75.56,132.55 | 75.56,132.55 74.29,133.82 IC23.11 | 75.56,132.55 97.15,132.55 98.42,133.82 IC24.11 | v161.28,96.35 v155.57,96.35 | v150.49,133.19 149.86,132.55 146.68,132.55 146.05,133.19 146.05,137 103.5,137 v102.87,136.36 | v43.81,83.02 40,83.02 33.65,76.67 IC9.3
DAR10  (via drill 0.61)  (1 unrouted)
  Top 0.254: IC12.28 38.09,23.96 39.36,25.23 39.36,43.02 38.09,44.29 IC11.28 38.09,46.83 39.36,48.09 39.36,65.88 38.09,67.14 IC10.28 38.09,69.68 39.36,70.95 39.36,88.73 38.09,90 IC9.28 | v139.69,69.68 140.33,70.32 140.33,77.94 137.79,80.48 DAR8-11.2
  Bottom 0.254: v139.69,69.68 154.94,69.68 156.21,70.95 IC6.13
DAR11  (via drill 0.61)
  Top 0.254: DAR8-11.3 138.43,78.57 139.69,77.3 139.69,70.95 138.43,69.68 139.06,69.05 139.06,63.34 v139.69,62.7 134.62,57.62 v134.62,48.09 | IC12.4 35.55,8.73 34.28,10 34.28,27.78 35.55,29.05 IC11.4 35.55,31.59 35.55,41.11 | IC9.4 35.55,74.77 35.55,73.49 34.28,72.22 34.28,55.72 35.55,54.45 IC10.4 35.55,51.91 35.55,48.09 34.28,46.83 34.28,44.29 35.55,43.02 35.55,41.11 | 35.55,41.11 v34.92,41.11
  Bottom 0.254: v139.69,62.7 140.33,63.34 145.41,63.34 146.05,62.7 154.3,62.7 156.84,65.24 IC6.11 | v134.62,48.09 133.34,46.83 128.27,46.83 125.73,49.37 110.48,49.37 106.04,44.92 98.42,44.92 97.79,44.29 97.79,41.11 87.62,41.11 86.99,41.74 68.58,41.74 67.94,41.11 v34.92,41.11
DIO00  (via drill 0.61)
  Top 0.254: IC12.17 66.04,23.96 67.31,25.23 67.31,31.59 66.67,32.22 66.67,42.38 67.31,43.02 67.31,65.88 66.04,67.14 IC10.17 66.04,69.68 v66.04,72.86 | v40.63,81.11 40.63,88.73 39.36,90 39.36,101.43 35.55,105.24 IC15.12
  Bottom 0.254: IC15.12 36.19,105.88 37.46,104.61 53.97,104.61 55.24,105.88 IC14.12 | IC17.12 77.47,20.16 73.66,20.16 72.39,21.43 67.31,21.43 66.67,22.06 IC12.17 65.4,23.33 62.22,26.51 17.78,26.51 16.51,25.23 IC19.8 | v40.63,81.11 44.45,77.3 44.45,72.86 57.78,72.86 58.41,73.49 65.4,73.49 v66.04,72.86
DIO01  (via drill 0.61)
  Top 0.254: v56.51,110.32 58.41,108.42 58.41,107.78 IC14.11 58.41,105.24 57.14,103.97 v57.14,70.95 | v60.95,33.49 61.59,32.86 61.59,32.22 62.22,31.59 62.22,10 63.49,8.73 IC12.15 63.49,6.18 63.49,5.55 66.67,5.55 74.29,13.17 v74.29,25.23 | v15.87,48.09 13.96,46.19 13.96,44.29 13.33,43.65 13.33,32.22 14.6,30.95 IC19.6 | v57.14,55.72 v57.14,65.88
  Bottom 0.254: v56.51,110.32 41.9,110.32 38.73,107.15 IC15.11 | v60.95,33.49 28.57,33.49 26.67,31.59 21.59,31.59 20.95,30.95 17.14,30.95 16.51,30.32 IC19.6 | v74.29,25.23 77.47,25.23 IC17.14 | 57.14,51.27 34.92,51.27 34.28,51.91 34.28,56.98 29.21,56.98 24.12,51.91 19.68,51.91 v15.87,48.09 | 57.14,51.27 61.59,51.27 62.86,52.54 IC10.15 | v57.14,65.88 v57.14,70.95 | 57.14,51.27 v57.14,55.72
DIO02  (via drill 0.61)
  Top 0.254: v43.81,103.34 41.27,105.88 IC15.10 | IC17.16 78.1,29.68 76.83,28.41 76.83,16.98 77.47,16.35 77.47,11.27 74.93,8.73 74.93,2.38 64.77,2.38 60.95,6.18 IC12.14 60.95,8.73 v57.78,11.9 | v60.95,65.24 60.95,54.45 IC10.14
  Bottom 0.254: IC14.10 60.32,105.88 58.41,103.97 44.45,103.97 v43.81,103.34 43.17,103.97 35.55,103.97 34.28,105.24 34.28,108.42 17.14,108.42 3.81,95.08 3.81,64.6 6.98,64.6 | 6.98,36.66 12.69,36.66 13.96,35.4 IC19.4 | 6.98,36.66 6.34,36.03 6.34,11.9 v57.78,11.9 | v60.95,65.24 60.32,64.6 26.67,64.6 24.12,67.14 13.33,67.14 10.79,64.6 6.98,64.6 | 6.98,64.6 3.17,60.8 3.17,36.66 6.98,36.66
DIO03  (via drill 0.61)
  Top 0.254: v58.41,65.88 58.41,54.45 IC10.13 | v60.95,70.95 62.22,72.22 62.22,103.97 63.49,105.24 IC14.9 63.49,107.78 v64.77,109.05 | v57.14,39.2 57.14,21.43 56.51,20.79 56.51,10.63 58.41,8.73 IC12.13 | v76.2,70.95 76.2,42.38 v73.02,39.2
  Bottom 0.254: v58.41,65.88 59.68,67.14 59.68,70.95 v60.95,70.95 v76.2,70.95 | v64.77,109.05 45.71,109.05 43.81,107.15 IC15.9 | IC19.2 16.51,40.48 17.78,39.2 v57.14,39.2 v73.02,39.2 76.83,35.4 77.47,35.4 IC17.18
DIO04  (via drill 0.61)
  Top 0.254: v73.66,93.18 73.66,97.62 IC13.2 | v26.67,62.7 26.67,65.88 24.12,65.88 IC18.17 | v67.94,42.38 67.94,60.16 69.21,61.43 | 69.21,61.43 70.48,62.7 IC16.3 | 69.21,61.43 v69.21,90.64
  Bottom 0.254: 69.21,93.18 v73.66,93.18 | 69.21,93.18 57.78,93.18 56.51,91.91 IC9.21 | v26.67,62.7 27.3,63.34 69.84,63.34 IC16.3 | v67.94,42.38 57.78,42.38 55.88,44.29 IC11.21 | v69.21,90.64 69.21,93.18
DIO05  (via drill 0.61)
  Top 0.254: IC13.1 71.12,97.62 v71.12,89.37 71.75,88.73 71.75,70.32 73.02,69.05 73.02,60.16 71.75,58.89 IC16.5 | IC18.15 24.12,60.8 v26.67,58.26 v26.67,48.09
  Bottom 0.254: v71.12,89.37 60.32,89.37 59.05,90.64 IC9.20 | v26.67,58.26 69.84,58.26 IC16.5 | v26.67,48.09 57.14,48.09 58.41,46.83 IC11.20
DIO06  (via drill 0.61)
  Top 0.254: 72.39,104.61 73.02,104.61 73.02,105.88 IC13.13 | 72.39,104.61 70.48,104.61 69.84,105.24 69.84,110.32 64.77,110.32 62.22,107.78 62.22,105.24 59.68,102.7 59.68,93.81 60.95,92.54 IC9.19 | v69.21,46.83 69.21,51.27 70.48,52.54 IC16.7 71.75,53.81 74.93,56.98 74.93,69.68 72.39,72.22 72.39,104.61 | v25.39,49.37 25.39,53.18 23.49,55.08 IC18.13
  Bottom 0.254: v69.21,46.83 68.58,47.46 62.86,47.46 61.59,46.19 IC11.19 60.32,46.19 57.14,49.37 v25.39,49.37
DIO07  (via drill 0.61)
  Top 0.254: 64.77,100.8 v64.77,103.34 | 64.77,100.8 64.77,93.81 63.49,92.54 IC9.18 | v63.49,50.63 63.49,46.83 IC11.18 | v67.31,100.8 64.77,100.8 | v69.21,98.89 69.84,98.26 69.84,91.27 70.48,90.64 70.48,90 69.84,89.37 69.84,77.3 v70.48,76.67 | v73.66,75.4 74.93,74.13 74.93,70.95 75.56,70.32 75.56,52.54 71.75,48.73 IC16.9
  Bottom 0.254: v64.77,103.34 66.04,104.61 74.29,104.61 75.56,105.88 IC13.12 | IC18.11 24.12,50.63 v63.49,50.63 67.31,50.63 69.84,48.09 IC16.9 | v69.21,98.89 v67.31,100.8 | v70.48,76.67 71.75,75.4 v73.66,75.4
DIO08  (via drill 0.61)
  Top 0.254: 78.73,85.56 78.73,96.35 77.47,97.62 77.47,103.97 78.73,105.24 IC13.11 | 78.73,85.56 78.73,70.95 80.64,69.05 80.64,50 79.37,48.73 IC16.12 | IC11.17 66.04,46.83 64.77,48.09 v64.77,85.56 64.77,88.73 66.04,90 IC9.17 | v18.41,45.55 v18.41,55.72 | v77.47,85.56 78.73,85.56
  Bottom 0.254: v18.41,55.72 16.51,55.72 IC18.8 | v18.41,45.55 19.68,46.83 26.67,46.83 27.3,47.46 56.51,47.46 57.14,46.83 57.14,44.29 57.78,43.65 64.13,43.65 65.4,44.92 IC11.17 | v64.77,85.56 v77.47,85.56
DIO09  (via drill 0.61)
  Top 0.254: IC9.15 63.49,74.77 63.49,72.22 62.22,70.95 v62.22,59.52 v62.22,55.08 62.22,32.86 63.49,31.59 IC11.15 | v80.01,78.57 80.01,100.16 80.64,100.8 80.64,104.61 81.28,105.24 IC13.10
  Bottom 0.254: v62.22,59.52 17.78,59.52 16.51,60.8 IC18.6 | v62.22,55.08 66.67,55.08 67.31,54.45 76.2,54.45 77.47,53.18 IC16.14 | v80.01,78.57 79.37,77.94 65.4,77.94 64.13,76.67 IC9.15
DIO10  (via drill 0.61)
  Top 0.254: IC11.14 60.95,31.59 59.68,32.86 v59.68,60.8 59.68,73.49 60.95,74.77 IC9.14 60.95,77.3 v60.95,83.02 | v24.76,64.6 25.39,63.97 v25.39,62.06 | v71.12,103.34 67.94,100.16 v67.94,83.02
  Bottom 0.254: IC16.16 77.47,58.26 76.2,59.52 63.49,59.52 62.22,60.8 v59.68,60.8 26.67,60.8 v25.39,62.06 | v24.76,64.6 17.78,64.6 16.51,65.88 IC18.4 | v71.12,103.34 80.64,103.34 83.18,105.88 IC13.9 | v60.95,83.02 v67.94,83.02
DIO11  (via drill 0.61)
  Top 0.254: IC9.13 58.41,74.77 v58.41,72.22 58.41,70.95 57.14,69.68 57.14,67.14 55.88,65.88 v55.88,62.06 55.88,55.72 57.14,54.45 57.14,44.29 58.41,43.02 58.41,31.59 IC11.13 | v85.09,72.22 85.09,103.97 86.36,105.24 IC13.8
  Bottom 0.254: IC18.2 16.51,70.95 17.78,72.22 v58.41,72.22 60.95,72.22 61.59,71.59 66.04,71.59 66.67,72.22 v85.09,72.22 | v55.88,62.06 72.39,62.06 73.02,62.7 76.83,62.7 77.47,63.34 IC16.18
DIOEVEN  (via drill 0.61)
  Top 0.254: v20.95,105.24 v20.95,62.06 20.95,50 24.76,46.19 24.76,26.51 v26.03,25.23
  Bottom 0.254: IC17.9 69.84,20.16 66.04,20.16 64.13,22.06 IC12.18 62.86,23.33 60.95,25.23 v26.03,25.23 | v20.95,62.06 24.12,62.06 26.03,63.97 63.49,63.97 63.49,67.14 IC10.18 | v20.95,105.24 29.21,105.24 29.84,104.61 31.11,104.61 32.38,105.88 IC15.13
DMA00  (via drill 0.61)
  Top 0.254: IC9.25 45.71,90 46.98,88.73 46.98,74.77 46.35,74.13 46.35,70.32 45.71,69.68 IC10.25 45.71,67.14 46.35,66.51 46.35,55.08 46.98,54.45 46.98,50.63 45.71,49.37 45.71,46.83 IC11.25 46.35,44.92 46.35,32.22 46.98,31.59 46.98,29.05 46.35,28.41 46.35,24.6 45.71,23.96 IC12.25 45.71,21.43 45.71,10 46.98,8.73 v46.98,5.55 | v147.95,16.35 147.95,11.9 149.22,10.63 IC8.8 | v140.97,12.54 v140.97,16.35
  Bottom 0.254: v46.98,5.55 66.67,5.55 67.94,6.82 82.55,6.82 83.81,8.09 122.55,8.09 123.19,7.46 DMA0-3.7 125.73,7.46 129.53,11.27 139.69,11.27 v140.97,12.54 | v140.97,16.35 v147.95,16.35
DMA01  (via drill 0.61)